# Altium schematic sheet BIA1.SchDoc
size A3
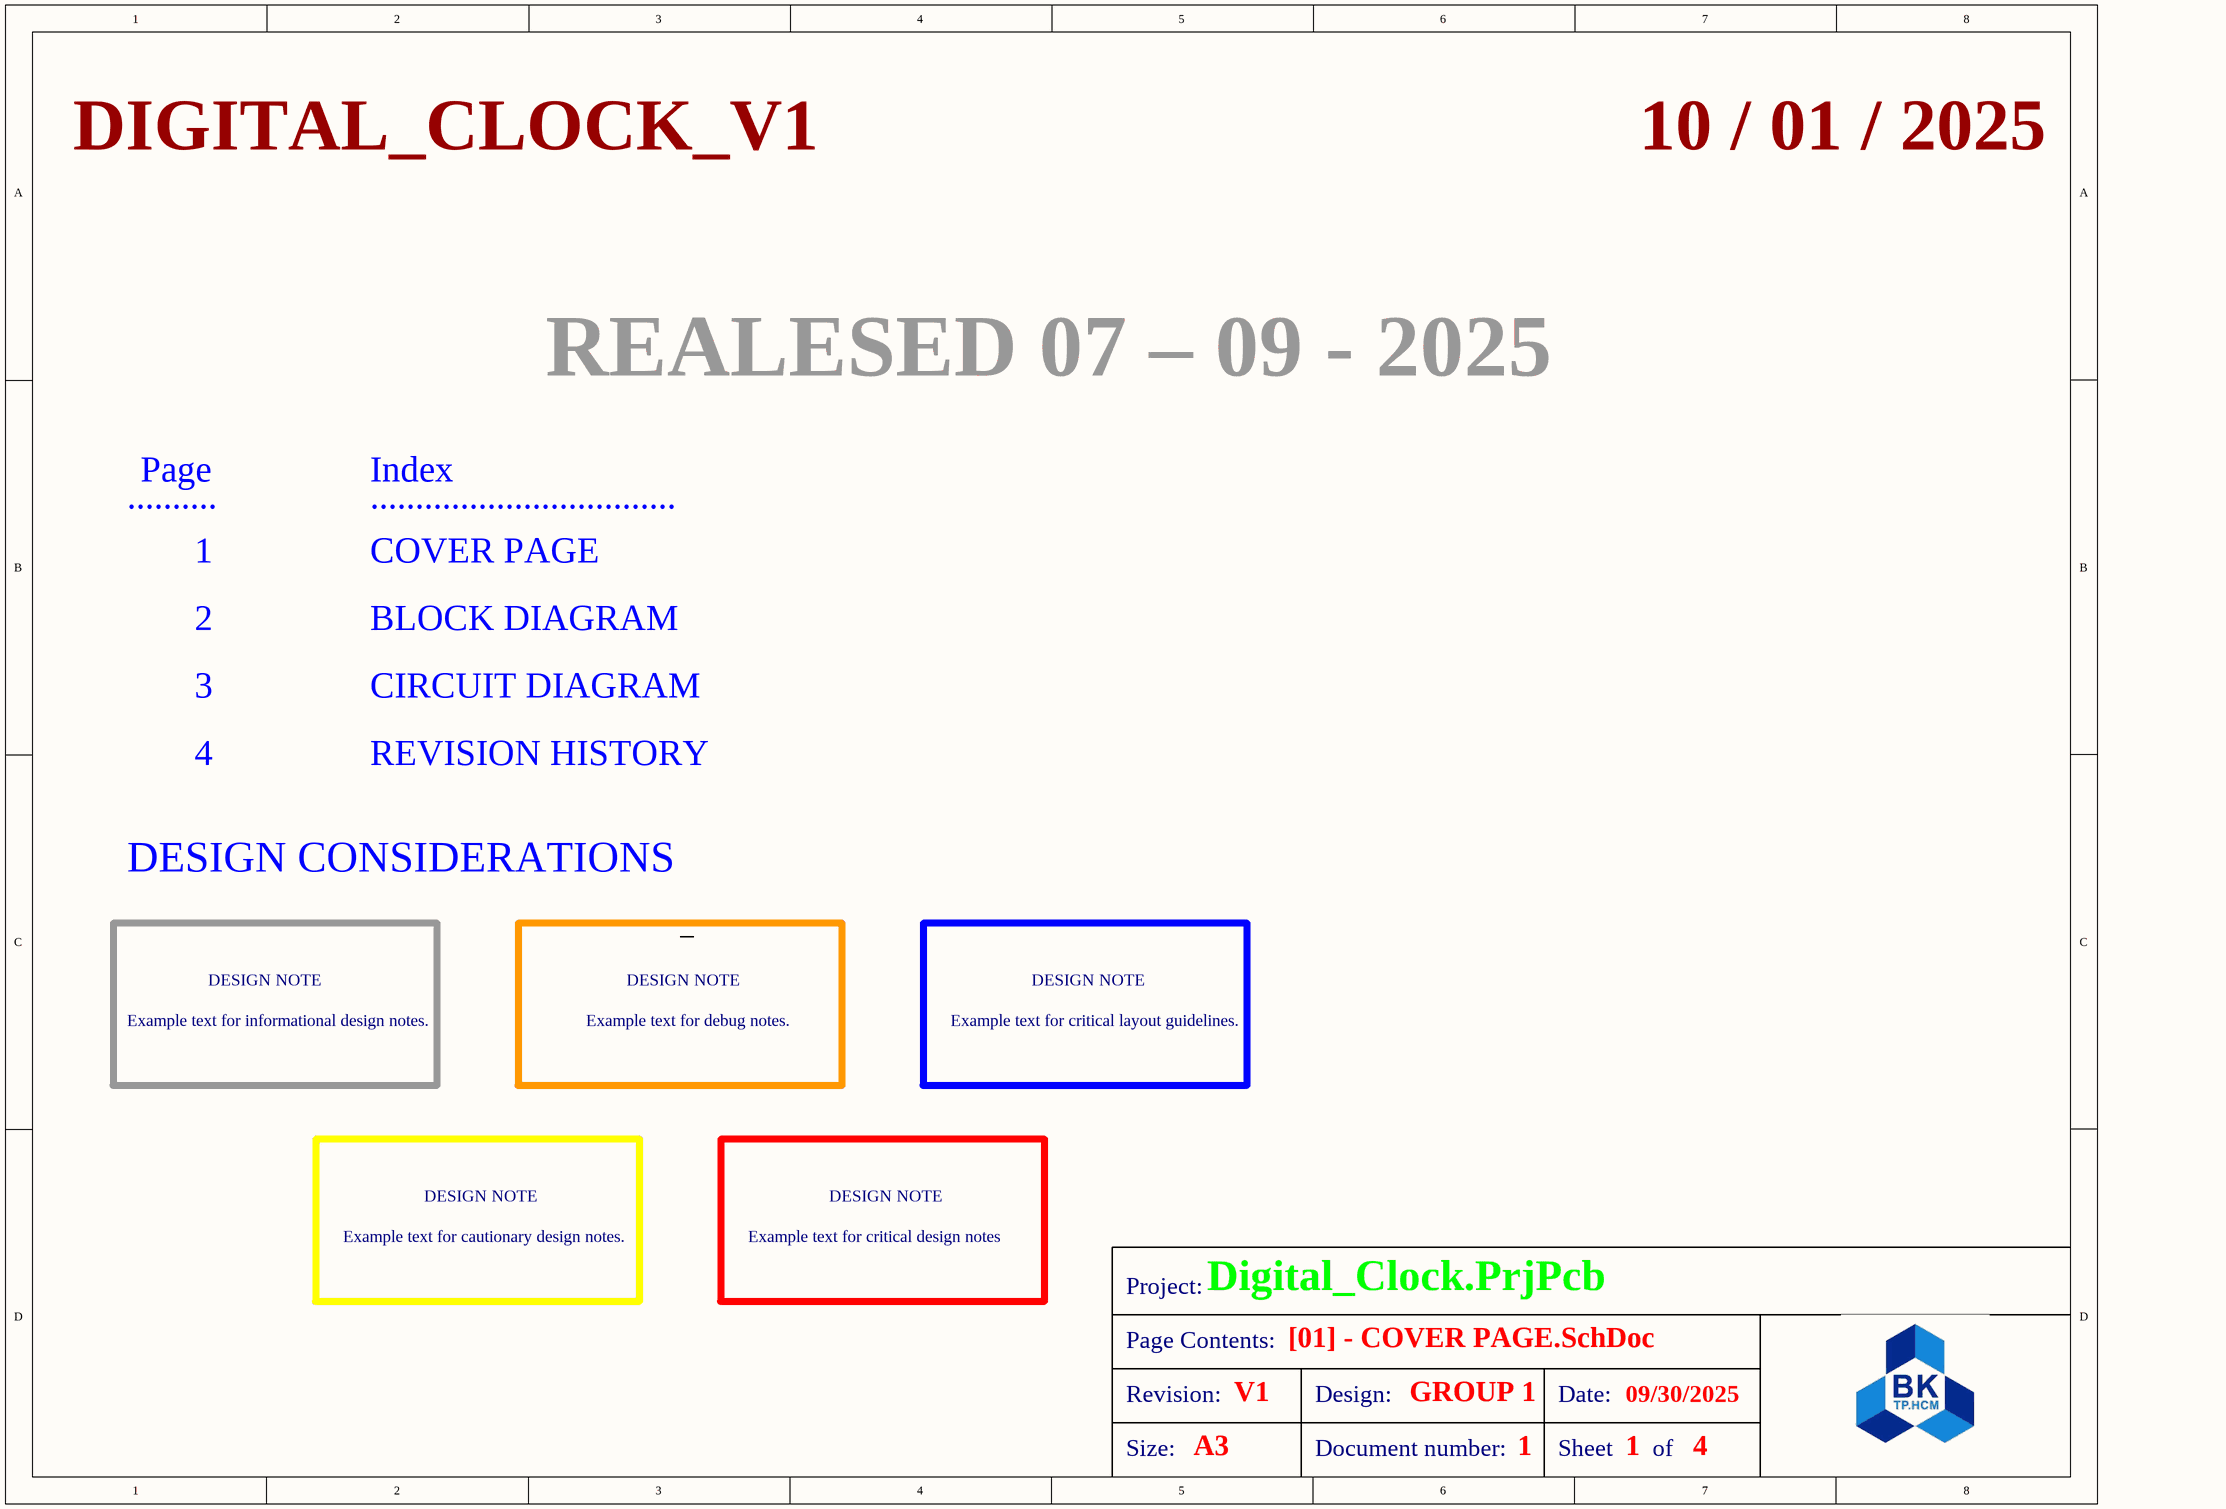
[diagram p0: BIA1.SchDoc]

## Notes on the sheet
- DIGITAL_CLOCK_V1
- 10 / 01 / 2025
- REALESED 07 – 09 - 2025
- ..........
- Page
- Index
- ..................................
- 1
- COVER PAGE
- 2
- BLOCK DIAGRAM
- 3
- CIRCUIT DIAGRAM
- 4
- REVISION HISTORY
- DESIGN CONSIDERATIONS
- DESIGN NOTE
- Example text for informational design notes.
- Example text for debug notes.
- Example text for critical layout guidelines.
- Example text for cautionary design notes.
- Example text for critical design notes
- [01] - COVER PAGE.SchDoc
- A3
- V1
- GROUP 1
- 09/30/2025
- Project:
- Digital_Clock.PrjPcb
- Page Contents:
- Revision:
- Size:
- Design:
- Document number:
- Date:
- Sheet
- of